# EAGLE design Board Design (EAGLE 9.6.0)
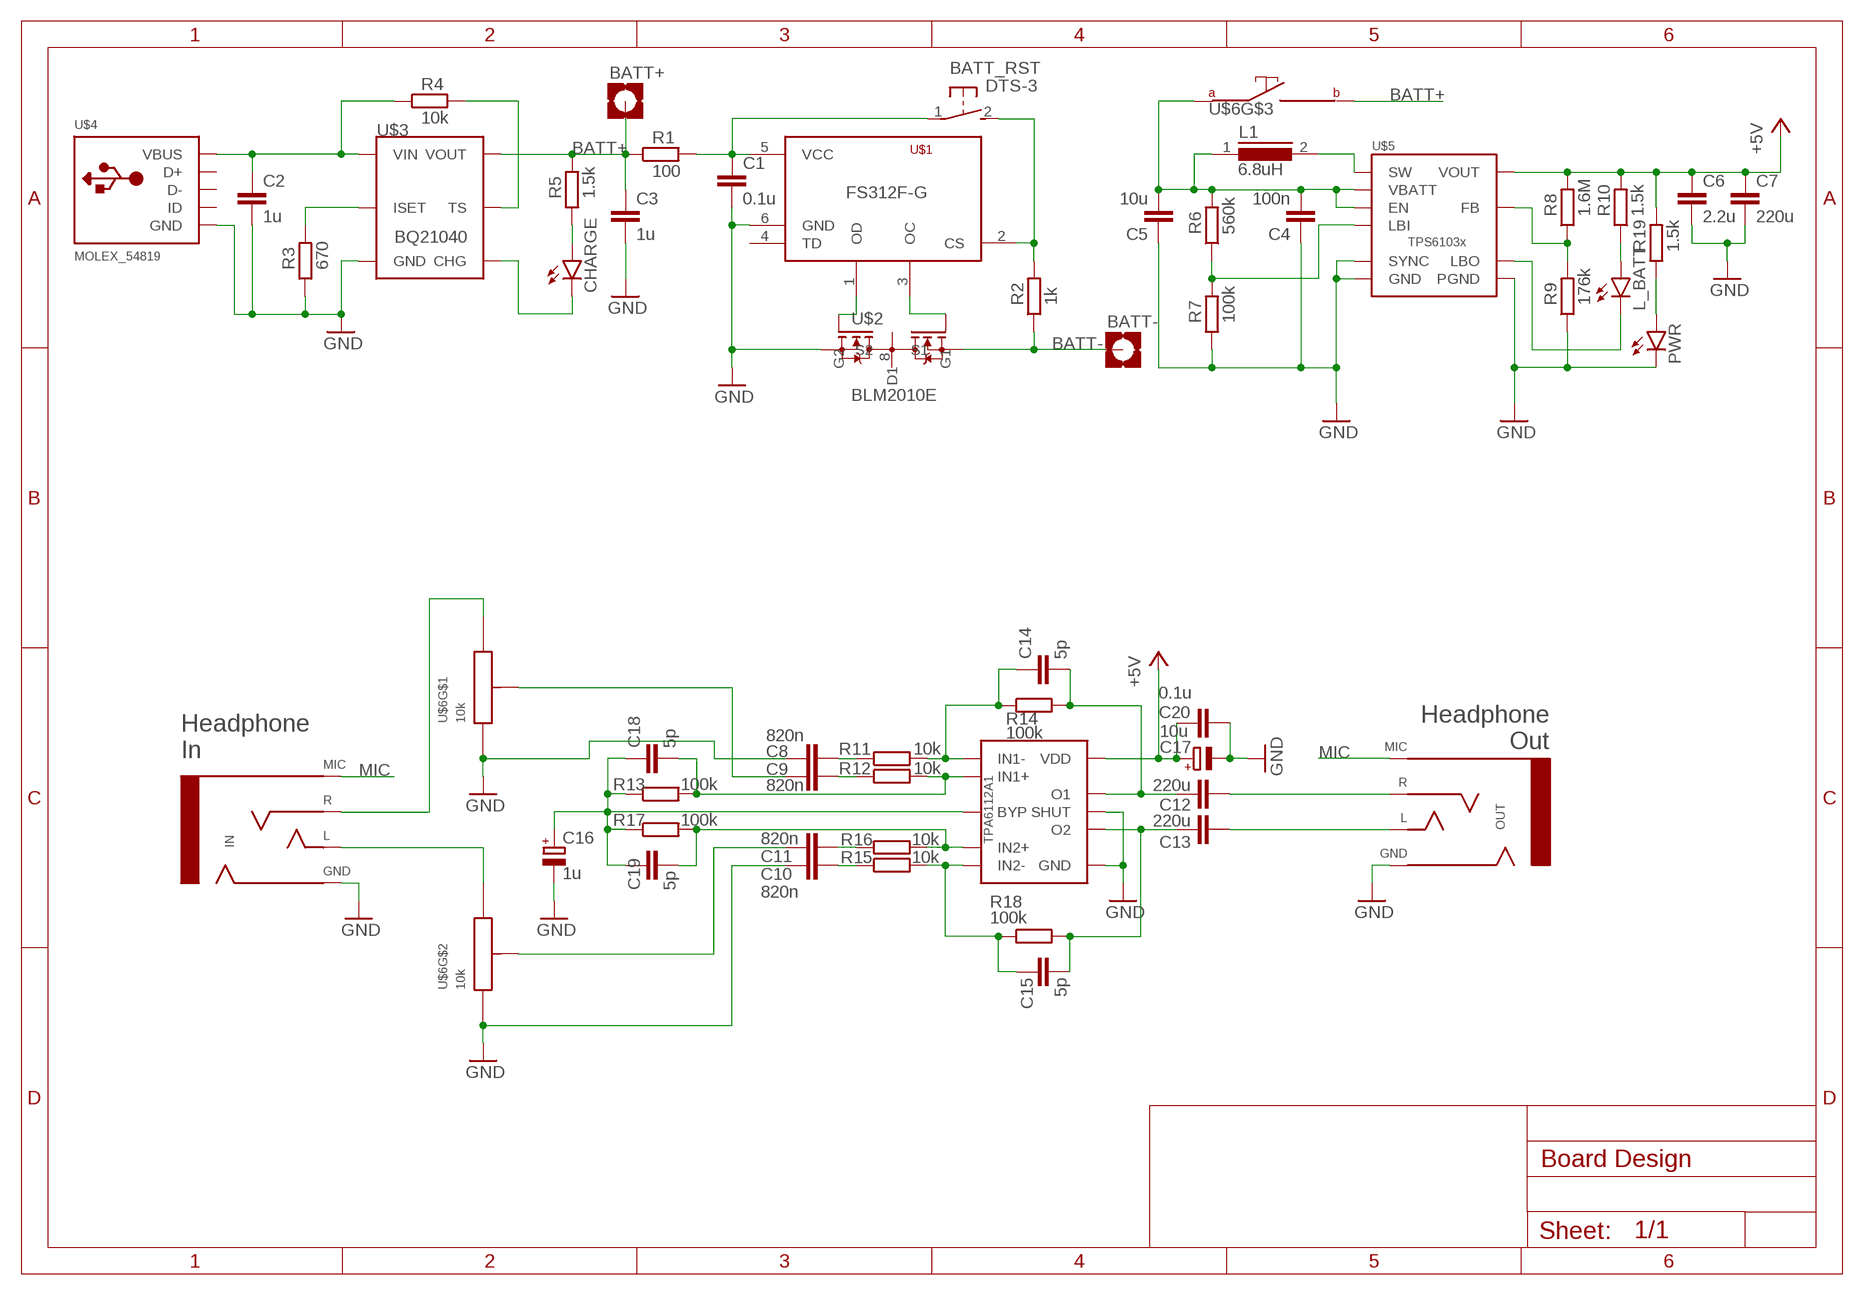
[diagram p0: schematic, sheet 1]

## Parts
BATT+  MOUNT-PAD-SQUARE2.8  [2,8-PAD-SQUARE]
BATT-  MOUNT-PAD-SQUARE2.8  [2,8-PAD-SQUARE]
BATT_RST  DTS-3  [DTS-3]
C1  0.1u  C-EUC1206  [C1206]
C2  1u  C-EUC1206  [C1206]
C3  1u  C-EUC1206  [C1206]
C4  100n  C-EUC1206  [C1206]
C5  10u  C-EUC1206  [C1206]
C6  2.2u  C-EUC1206  [C1206]
C7  220u  C-EUC1206  [C1206]
C8  820n  C-EUC1812  [C1812]
C9  820n  C-EUC1812  [C1812]
C10  820n  C-EUC1812  [C1812]
C11  820n  C-EUC1812  [C1812]
C12  220u  C-EUC1210  [C1210]
C13  220u  C-EUC1210  [C1210]
C14  5p  C-EUC1206  [C1206]
C15  5p  C-EUC1206  [C1206]
C16  1u  CPOL-EUB  [PANASONIC_B]
C17  10u  CPOL-EUB  [PANASONIC_B]
C18  5p  C-EUC1206  [C1206]
C19  5p  C-EUC1206  [C1206]
C20  0.1u  C-EUC1206  [C1206]
CHARGE  LEDSMT1206  [1206]
IN  PJ-35372  [PJ-35372]
L1  6.8uH  DR127  [DR127]
L_BATT  LEDSMT1206  [1206]
OUT  PJ-35372  [PJ-35372]
PWR  LEDSMT1206  [1206]
R1  100  R-EU_M1206  [M1206]
R2  1k  R-EU_M1206  [M1206]
R3  670  R-EU_M1206  [M1206]
R4  10k  R-EU_M1206  [M1206]
R5  1.5k  R-EU_M1206  [M1206]
R6  560k  R-EU_M1206  [M1206]
R7  100k  R-EU_M1206  [M1206]
R8  1.6M  R-EU_M1206  [M1206]
R9  176k  R-EU_M1206  [M1206]
R10  1.5k  R-EU_M1206  [M1206]
R11  10k  R-EU_0204/2V  [0204V]
R12  10k  R-EU_0204/2V  [0204V]
R13  100k  R-EU_0204/2V  [0204V]
R14  100k  R-EU_0204/2V  [0204V]
R15  10k  R-EU_0204/2V  [0204V]
R16  10k  R-EU_0204/2V  [0204V]
R17  100k  R-EU_0204/2V  [0204V]
R18  100k  R-EU_0204/2V  [0204V]
R19  1.5k  R-EU_M1206  [M1206]
TPA6112A1  TPA6112A2  [MSOP-10]
U$1  FS312F-G  [SOT23-6]
U$2  BLM2010E  [TSSOP8]
U$3  BQ21040M  [SOT23-6]
U$4  MOLEX_54819  [MOLEX_54819]
U$5  TPS61032  [TSSOP16L]
U$6  10k  RK097-DUAL-W/SWITCH  [RK097-DUAL-ELEMENT-W/SWITCH]

## Nets
+5V [Power]: C6.1 C7.1 C17.+ C20.1 R8.2 R10.2 R19.2 TPA6112A1.10(VDD) U$5.13(VOUT) U$5.14(VOUT) U$5.15(VOUT)
BATT+ [Power]: BATT+.B2,8(MOUNT) C3.1 R1.1 R5.2 U$3.2(VOUT) U$6.S2
BATT- [Power]: BATT-.B2,8(MOUNT) R2.1 U$2.2(S1) U$2.3(S1)
GND: C1.2 C2.2 C3.2 C4.1 C5.1 C6.2 C7.2 C8.1 C10.1 C16.- C17.- C20.2 IN.2(R2) IN.6(R2) OUT.2(R2) OUT.6(R2) PWR.C R3.1 R7.1 R9.1 TPA6112A1.5(GND) TPA6112A1.6(SHUT) U$1.6(GND) U$2.6(S2) U$2.7(S2) U$3.5(GND) U$4.GND U$5.3(PGND) U$5.4(PGND) U$5.5(PGND) U$5.8(SYNC) U$5.11(GND) U$6.1-1 U$6.2-1
MIC: IN.1(S) IN.5(S) OUT.1(S) OUT.5(S)
MNVMNV [Power]: C4.2 C5.2 L1.1 R6.2 U$5.6(VBATT) U$5.9(EN) U$6.S1
N$1 [Power]: C2.1 R4.1 U$3.4(VIN) U$4.VBUS
N$2: BATT_RST.1 C1.1 R1.2 U$1.5(VCC)
N$3: U$1.3(OC) U$2.4(G1)
N$4: U$1.1(OD) U$2.5(G2)
N$5: R3.2 U$3.6(ISET)
N$6: BATT_RST.2 R2.2 U$1.2(CS)
N$7: R4.2 U$3.1(TS)
N$8: CHARGE.A R5.1
N$9: CHARGE.C U$3.3(CHG)
N$10 [Power]: L1.2 U$5.1(SW) U$5.2(SW)
N$11: L_BATT.C U$5.10(LBO)
N$12: L_BATT.A R10.1
N$13: C16.+ C18.1 C19.1 R13.1 R17.1 TPA6112A1.4(BYP)
N$14: R8.1 R9.2 U$5.12(FB)
N$15: PWR.A R19.1
N$16: C12.1 C14.2 R14.2 TPA6112A1.1(O1)
N$17: R6.1 R7.2 U$5.7(LBI)
N$18: C13.1 C15.2 R18.2 TPA6112A1.9(O2)
N$19: C8.2 R11.1
N$20: C9.2 R12.1
N$21: C18.2 R12.2 R13.2 TPA6112A1.3(IN1+)
N$22: C14.1 R11.2 R14.1 TPA6112A1.2(IN1-)
N$23: C11.1 U$6.2-3
N$24: C19.2 R16.2 R17.2 TPA6112A1.7(IN2+)
N$25: C11.2 R16.1
N$26: C10.2 R15.1
N$27: C15.1 R15.2 R18.1 TPA6112A1.8(IN2-)
N$28: C9.1 U$6.1-3
N$30: IN.4(T) IN.8(T) U$6.2-2
N$31: IN.3(R1) IN.7(R1) U$6.1-2
N$32 [Power]: C13.2 OUT.4(T) OUT.8(T)
N$33 [Power]: C12.2 OUT.3(R1) OUT.7(R1)
Unconnected: U$1.4(TD) U$2.1(D1) U$2.8(D2) U$4.D+ U$4.D- U$4.ID

## Notes on the sheet
- Headphone
  Out
- Headphone
  In

## Library data of the parts
BATT+ BATT- = holes:MOUNT-PAD-SQUARE: MOUNTING PAD, square
BATT_RST = switch-tact:DTS-3
C1-C15 C18-C20 = rcl:C-EU: CAPACITOR, European symbol; SPICEPREFIX: C
C16 C17 = rcl:CPOL-EU: POLARIZED CAPACITOR, European symbol; SPICEPREFIX: C
CHARGE L_BATT PWR = led:LED: LED OSRAM: - CHIPLED LG R971, LG N971, LY N971, LG Q971, LY Q971, LO R971, LY R971 LH N974, LH R974 LS Q976, LO Q976, LY Q976 LO Q996 - Hyper CHIPLED LW Q18S LB Q993, LB Q99A, LB R99A - SideLED LS A670, LO A670, LY A670, LG A670, LP A670 LB A673, LV A673, LT A673, LW A673 LH A674 LY A675 LS A676, LA A676, LO A676, LY A676, LW A676 LS A679, LY A679, LG A679 - Hyper Micro SIDELED® LS Y876, LA Y876, LO Y876, LY Y876 LT Y87S - SmartLED LW L88C, LW L88S LB L89C, LB L89S, LG L890 LS L89K, LO L89K, LY L89K LS L896, LA L896, LO L896, LY L896 - TOPLED LS T670, LO T670, LY T670, LG T670, LP T670 LSG T670, LSP T670, LSY T670, LOP T670, LYG T670 LG T671, LOG T671, LSG T671 LB T673, LV T673, LT T673, LW T673 LH T674 LS T676, LA T676, LO T676, LY T676, LB T676, LH T676, LSB T676, LW T676 LB T67C, LV T67C, LT T67C, LS T67K, LO T67K, LY T67K, LW E67C LS E67B, LA E67B, LO E67B, LY E67B, LB E67C, LV E67C, LT E67C LW T67C LS T679, LY T679, LG T679 LS T770, LO T770, LY T770, LG T770, LP T770 LB T773, LV T773, LT T773, LW T773 LH T774 LS E675, LA E675, LY E675, LS T675 LS T776, LA T776, LO T776, LY T776, LB T776 LHGB T686 LT T68C, LB T68C - Hyper Mini TOPLED® LB M676 - Mini TOPLED Santana® LG M470 LS M47K, LO M47K, LY M47K Source: http://www.osram.convergy.de LUXEON: - LUMILED® LXK2-PW12-R00, LXK2-PW12-S00, LXK2-PW14-U00, LXK2-PW14-V00 LXK2-PM12-R00, LXK2-PM12-S00, LXK2-PM14-U00 LXK2-PE12-Q00, LXK2-PE12-R00, LXK2-PE12-S00, LXK2-PE14-T00, LXK2-PE14-U00 LXK2-PB12-K00, LXK2-PB12-L00, LXK2-PB12-M00, LXK2-PB14-N00, LXK2-PB14-P00, LXK2-PB14-Q00 LXK2-PR12-L00, LXK2-PR12-M00, LXK2-PR14-Q00, LXK2-PR14-R00 LXK2-PD12-Q00, LXK2-PD12-R00, LXK2-PD12-S00 LXK2-PH12-R00, LXK2-PH12-S00 LXK2-PL12-P00, LXK2-PL12-Q00, LXK2-PL12-R00 Source: www.luxeon.com KINGBRIGHT: KA-3528ASYC Source: www.kingbright.com
IN OUT = Connectors_Custom:PJ-35372
L1 = inductors:DR127: High Power Density, High Efficiency, Shielded Inductors Source: coiltronics_dr_series.pdf; SPICEPREFIX: L
R1-R19 = rcl:R-EU_: RESISTOR, European symbol; SPICEPREFIX: R
TPA6112A1 = Misc ICs:TPA6112A2
U$1 = Misc ICs:FS312F-G
U$2 = Misc ICs:BLM2010E
U$3 = Misc ICs:BQ21040M; SPICEPREFIX: X
U$4 = Connectors_Custom:MOLEX_54819
U$5 = Misc ICs:TPS61032; SPICEPREFIX: X
U$6 = alps_japan_potentiometers:RK097-DUAL-W/SWITCH: My symbol for Apls RK097 Dual Pot with Switch Part.

## Net classes
1 Power: width 0.15 mm, clearance 0.15 mm

## Board
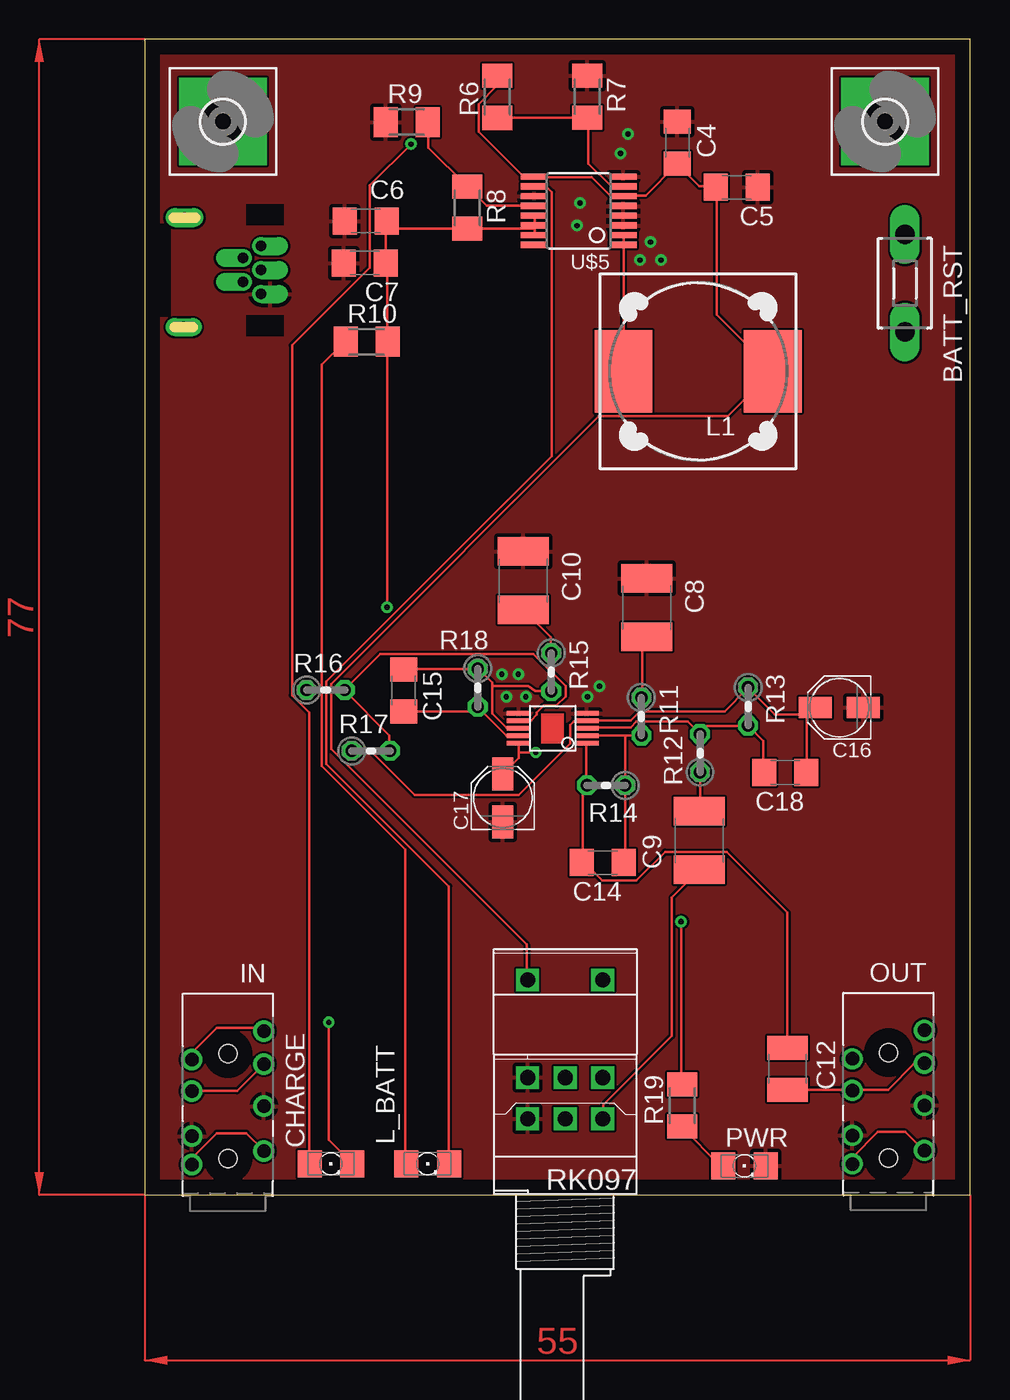
[diagram p1: board, top side]
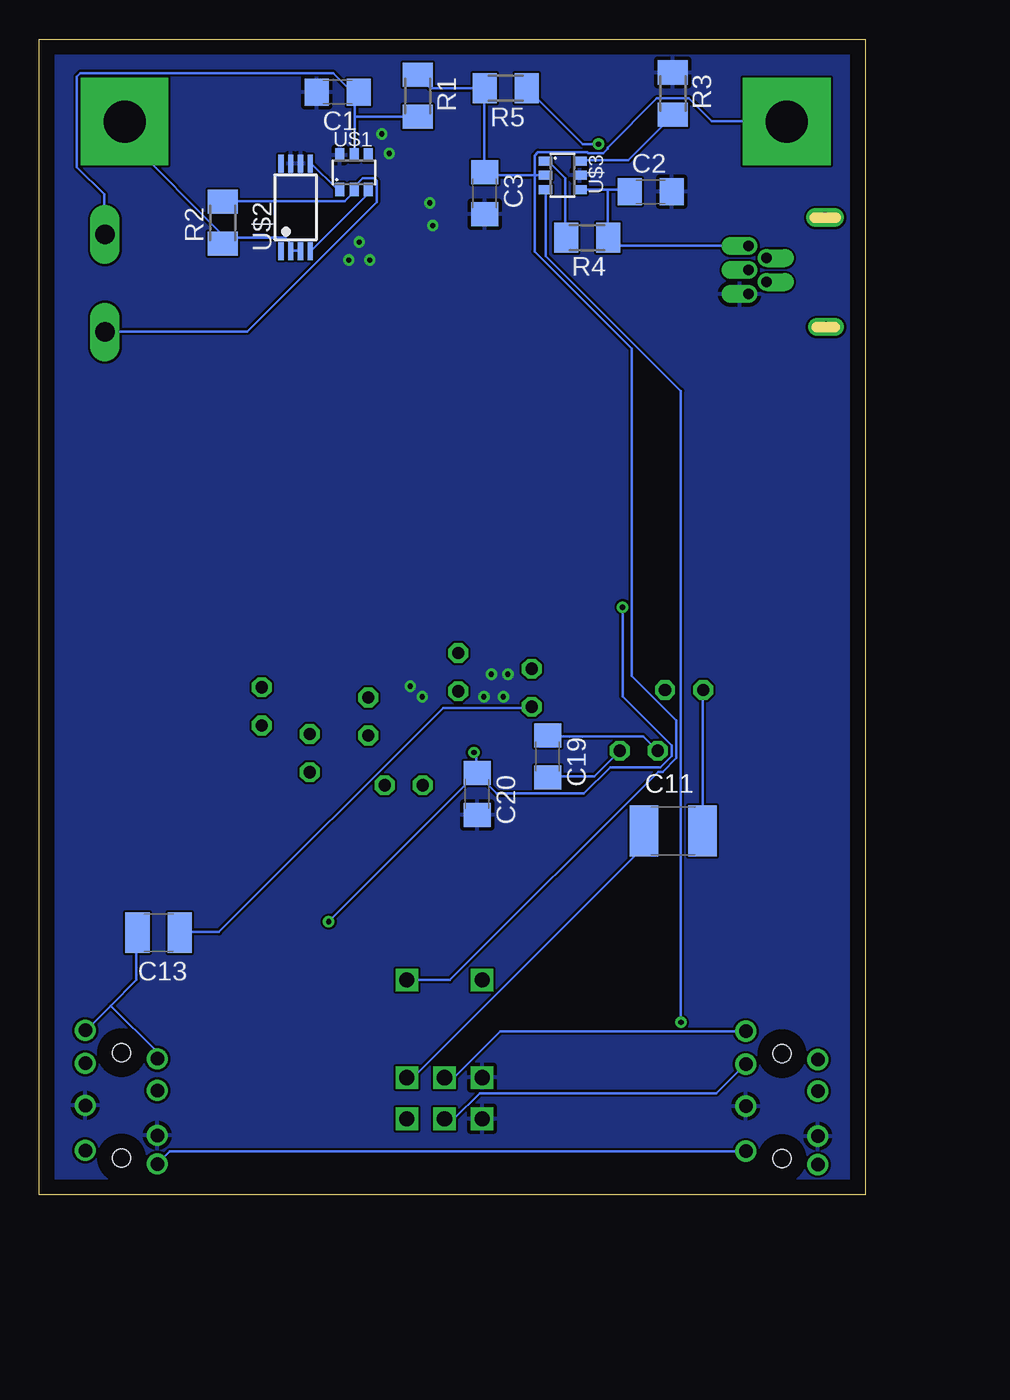
[diagram p2: board, bottom side, seen from below]

Size 55 x 77 mm. Coordinates in mm from the lower left corner, seen from the top.
Outline: 0,0 55,0 55,77 0,77 0,0
Copper layers (1*16): Top 0.035mm / dielectric 1.5mm / Bottom 0.035mm
Design rules "default": minimum track width 6mil, minimum drill 0.35mm, track to track 6mil, track to pad 6mil, pad to pad 6mil, via to via 6mil, smd to smd 6mil, copper to edge 40mil, drill to drill 6mil, minimum pad ring 10mil, minimum via ring 8mil, stop-mask expansion 4mil, vias tented up to drill 0mil, thermal gap 10mil

### Footprints (pad centres in the part's own frame; a part is rotated, then mirrored left to right if it is on the bottom)
2,8-PAD-SQUARE = drill 2.8 pad 5.842 square: B2,8 0,0
DTS-3 = drill 1.3 long: 1 -3.25,0; 2 3.25,0
C1206 = smd 1.6 x 1.8: 1 -1.4,0; 2 1.4,0
C1812 = smd 1.9 x 3.4: 1 -1.95,0; 2 1.95,0
C1210 = smd 1.6 x 2.7: 1 -1.4,0; 2 1.4,0
PANASONIC_B = smd 2.2 x 1.4: + 1.6,0; - -1.6,0
1206 = smd 1.6 x 1.803: A -1.422,0; C 1.422,0
PJ-35372 = drill 0.9: 1 4,-2.4; 2 7,-2.4; 3 9.8,-2.4; 4 12,-2.4; 5 3.1,2.4; 6 5,2.4; 7 8,2.4; 8 10.1,2.4 | hole 1.2: 3.5,0; 10.5,0
DR127 = smd 3.85 x 5.5: 1 -4.975,0; 2 4.975,0
M1206 = smd 1.6 x 2: 1 -1.4,0; 2 1.4,0
0204V = drill 0.813 octagon: 1 -1.27,0; 2 1.27,0
MSOP-10 = smd 0.3 x 1.6: 1 -1,-2.25; 2 -0.5,-2.25; 3 0,-2.25; 4 0.5,-2.25; 5 1,-2.25; 6 1,2.25; 7 0.5,2.25; 8 0,2.25; 9 -0.5,2.25; 10 -1,2.25
SOT23-6 = smd 0.6 x 0.9: 1 -0.95,-1.15; 2 0,-1.15; 3 0.95,-1.15; 4 0.95,1.15; 5 0,1.15; 6 -0.95,1.15
TSSOP8 = smd 0.35 x 1.2: 1 -0.975,-2.925; 2 -0.325,-2.925; 3 0.325,-2.925; 4 0.975,-2.925; 5 0.975,2.925; 6 0.325,2.925; 7 -0.325,2.925; 8 -0.975,2.925
MOLEX_54819 = drill 0.7 offset: D+ 0,0; D- -1.2,0.8; GND 0,-1.6; ID -1.2,-0.8; VBUS 0,1.6 | drill 0.7 long: P$1 -5.15,-3.8 | drill 0.7 pad 1.27 long: P$2 -5.1,3.5
TSSOP16L = smd 0.42 x 1.78: 1 -2.275,-2.97; 2 -1.625,-2.97; 3 -0.975,-2.97; 4 -0.325,-2.97; 5 0.325,-2.97; 6 0.975,-2.97; 7 1.625,-2.97; 8 2.275,-2.97; 9 2.275,2.97; 10 1.625,2.97; 11 0.975,2.97; 12 0.325,2.97; 13 -0.325,2.97; 14 -0.975,2.97; 15 -1.625,2.97; 16 -2.275,2.97
RK097-DUAL-ELEMENT-W/SWITCH = drill 1 pad 1.422 square: 1-1 -2.5,-0.06; 1-2 0,-0.06; 1-3 2.5,-0.06; 2-1 -2.5,2.69; 2-2 0,2.69; 2-3 2.5,2.69; S1 -2.5,9.19; S2 2.5,9.19

### Placement (x,y rotation side)
BATT+  5.22,71.53 0 top
BATT-  49.33,71.53 0 top
BATT_RST  50.64,60.75 270 top
C1  35.12,73.5 180 bottom
C2  14.29,66.85 0 bottom
C3  25.35,66.77 270 bottom
C4  35.5,70.13 270 top
C5  39.45,67.15 180 top
C6  14.73,64.9 180 top
C7  14.68,62.1 180 top
C8  33.44,39.14 270 top
C9  36.96,23.61 90 top
C10  25.24,40.94 270 top
C11  12.79,24.26 0 bottom
C12  42.83,8.39 270 top
C13  47.07,17.47 180 bottom
C14  30.53,22.15 180 top
C15  17.25,33.61 270 top
C16  46.29,32.47 180 top
C17  23.87,26.46 90 top
C18  42.69,28.15 180 top
C19  21.15,29.23 270 bottom
C20  25.85,26.71 270 bottom
CHARGE  12.41,2.08 0 top
IN  5.55,-1.08 90 top
L1  36.88,54.88 180 top
L_BATT  18.86,2.08 0 top
OUT  49.55,-1.03 90 top
PWR  39.96,1.94 0 top
R1  29.8,73.24 270 bottom
R2  42.8,64.78 90 bottom
R3  12.8,73.4 270 bottom
R4  18.52,63.8 180 bottom
R5  23.94,73.75 180 bottom
R6  23.5,73.17 90 top
R7  29.5,73.18 270 top
R8  21.5,65.78 270 top
R9  17.47,71.5 0 top
R10  14.79,56.85 0 top
R11  33.1,31.88 270 top
R12  37,29.44 90 top
R13  40.2,32.56 270 top
R14  30.74,27.3 180 top
R15  27.1,34.84 270 top
R16  12.06,33.65 0 top
R17  15.08,29.6 0 top
R18  22.2,33.8 270 top
R19  35.81,5.96 90 top
TPA6112A1  27.19,31.09 90 top
U$1  34.04,68.15 0 bottom
U$2  37.93,65.81 0 bottom
U$3  20.15,67.95 270 bottom
U$4  7.76,61.64 0 top
U$5  28.92,65.58 90 top
U$6  28.02,5.13 0 top

### Tracks (layer width: path | path; a pad name or v marks a point on that pad's centre or on a via)
+5V  (via drill 0.35)
  Top 0.152: 25.98,64.39 25.98,64.54 U$5.14 25.98,64.62 25.98,65.23 U$5.13 | 25.98,64.39 25.98,64.01 U$5.15 | 25.98,64.39 21.57,64.39 R8.2 21.49,64.39 16.08,64.39 | 16.08,64.39 16.08,64.85 C6.1 16.08,64.39 | 16.08,64.39 C7.1 16.15,62.03 16.15,56.92 R10.2 16.15,56.84 v16.15,39.17 | 24.92,29.49 24.92,29.11 23.93,28.12 C17.+ | 24.92,29.49 24.92,30.02 TPA6112A1.10 | 24.92,29.49 v26.06,29.49 | v35.74,18.21 35.74,7.39 R19.2
  Bottom 0.152: v26.06,29.49 25.91,29.34 25.91,28.12 C20.1 | v35.74,18.21 25.91,28.04 C20.1 | v16.15,39.17 16.15,33.22 12.88,29.95 12.88,29.26 13.64,28.5 16.99,28.5 18.75,26.75 24.54,26.75 25.83,28.04 C20.1
BATT+
  Bottom 0.152: 22.02,67.97 25.15,67.97 25.3,68.12 C3.1 25.38,68.2 25.38,73.69 R5.2 25.38,73.76 28.96,73.76 29.79,74.6 R1.1 | 22.02,67.97 21.34,67.97 U$3.2 | 22.02,67.97 22.02,62.87 15.54,56.39 15.54,34.59 12.57,31.62 12.57,29.11 13.49,28.19 13.79,28.19 27.66,14.33 30.48,14.33 U$6.S2 | 22.02,67.97 22.02,69.27 21.79,69.49 18.52,69.49 18.44,69.42 17.45,69.42 17.14,69.72 17.14,69.8 13.87,73.08 11.73,73.08 10.21,71.55 5.26,71.55 BATT+.B2,8
BATT-
  Bottom 0.152: U$2.3 37.64,62.94 38.25,62.94 U$2.2 38.25,63.02 38.25,63.4 38.63,63.78 42.37,63.78 42.75,63.4 R2.1 42.52,63.7 49.3,70.48 49.3,71.48 BATT-.B2,8
GND  (via drill 0.35)
  other vias: 32.2,70.7 31.7,69.4 29,66.1 28.8,64.6 33,62.3 34.4,62.3 33.7,63.5 23.8,34.7 24.9,34.7 24.1,33.2 25.4,33.2 29.5,33.2 30.3,33.9
  pour Top: -1,79 57,79 57,-3 -1,-3
  pour Bottom: -2,80 59,80 59,-5 -2,-5
MIC
  Top 0.152: IN.5 3.2,2.06 3.2,2.52 4.8,4.12 6.78,4.12 7.92,2.97 IN.1 | OUT.5 47.17,2.13 47.17,2.52 48.84,4.19 50.67,4.19 51.89,2.97 OUT.1
  Bottom 0.152: IN.1 8,2.9 46.33,2.9 47.09,2.13 OUT.5
MNVMNV
  Top 0.152: R6.2 23.47,74.52 23.47,73.91 22.25,72.69 22.25,70.87 25.22,67.89 25.91,67.89 U$5.9 25.98,67.82 29.79,67.82 31.01,66.6 31.85,66.6 U$5.6 31.93,66.6 33.38,66.6 35.43,68.66 C4.2 35.51,68.66 36.96,67.21 38.02,67.21 C5.2 38.1,67.13 38.1,58.67 41.83,54.94 L1.1 41.83,54.86 38.86,51.89 30.25,51.89 12.42,34.06 12.42,29.72 25.45,16.69 25.45,14.33 U$6.S1
N$1
  Bottom 0.152: 17.14,66.98 15.77,66.98 15.7,66.9 C2.1 | 17.14,66.98 18.97,66.98 U$3.4 | 17.14,66.98 17.14,63.86 R4.1 17.07,63.78 16.54,63.25 7.77,63.25 U$4.VBUS
N$2
  Bottom 0.152: 33.98,71.86 33.98,73.23 33.76,73.46 C1.1 33.98,73.3 35.43,74.75 52.27,74.75 52.5,74.52 52.5,68.5 50.67,66.67 50.67,64.01 BATT_RST.1 | 33.98,71.86 33.98,69.34 U$1.5 | 33.98,71.86 29.87,71.86 R1.2
N$3
  Bottom 0.152: U$1.3 33.15,66.98 33.15,66.67 36.88,62.94 U$2.4
N$4
  Bottom 0.152: U$1.1 35.05,67.06 35.2,67.06 36.88,68.73 U$2.5
N$5
  Bottom 0.152: U$3.6 18.97,68.96 15.77,68.96 12.8,71.93 R3.2
N$6
  Bottom 0.152: R2.2 42.75,66.22 34.67,66.22 34.06,66.83 34.06,66.98 U$1.2 33.98,67.06 33.98,67.21 33.45,67.74 32.69,67.74 32.54,67.59 32.54,66.14 41.15,57.53 50.6,57.53 BATT_RST.2
N$7
  Bottom 0.152: U$3.1 21.26,68.89 21.11,68.89 19.96,67.74 19.96,63.86 R4.2
N$8  (via drill 0.35)
  Top 0.152: v17.75,70.03 15.01,67.28 15.01,61.8 9.83,56.62 9.83,33.3 10.97,32.16 10.97,2.13 CHARGE.A
  Bottom 0.152: v17.75,70.03 18.82,70.03 22.48,73.69 R5.1
N$9  (via drill 0.35)
  Top 0.152: v12.27,11.51 12.27,3.66 13.79,2.13 CHARGE.C
  Bottom 0.152: v12.27,11.51 12.27,53.57 21.26,62.56 21.26,66.98 U$3.3
N$10
  Top 0.152: U$5.2 31.93,63.93 31.93,63.32 U$5.1 31.93,63.25 31.93,54.94 L1.2
N$11
  Top 0.152: U$5.10 25.98,67.13 26.82,67.13 27.13,66.83 27.13,49.23 12.12,34.21 12.12,28.73 20.27,20.57 20.27,2.13 L_BATT.C
N$12
  Top 0.152: L_BATT.A 17.37,2.13 17.37,23.01 11.81,28.57 11.81,55.32 13.34,56.84 R10.1
N$13
  Top 0.152: C18.1 44.12,28.19 44.12,31.93 44.65,32.46 C16.+ 44.12,32 41.99,32 40.23,33.76 R13.1 40.16,33.76 38.63,32.23 32.99,32.23 32.38,31.62 29.49,31.62 TPA6112A1.4 29.41,31.55 28.57,31.55 28.35,31.32 28.35,30.1 24.92,26.67 17.98,26.67 15.09,29.57 13.87,29.57 R17.1
  Bottom 0.152: C19.1 21.11,30.56 14.78,30.56 13.87,29.64 R17.1
N$14
  Top 0.152: U$5.12 25.91,65.91 22.78,65.91 21.57,67.13 R8.1 21.49,67.21 18.9,69.8 18.9,71.48 R9.2
N$15
  Top 0.152: PWR.A 38.48,1.98 38.33,1.98 35.81,4.5 R19.1
N$16
  Top 0.152: TPA6112A1.1 29.41,30.02 29.41,27.36 R14.2 29.41,27.28 29.18,27.05 29.18,22.17 C14.2 29.26,22.17 30.48,20.95 32.77,20.95 34.67,22.86 38.79,22.86 42.82,18.82 42.82,9.83 C12.1
N$17
  Top 0.152: U$5.7 31.85,67.21 31.09,67.21 29.57,68.73 29.57,71.7 R7.2 23.55,71.78 R6.1
N$18
  Top 0.152: TPA6112A1.9 24.92,30.63 24.08,30.63 22.25,32.46 R18.2 22.17,32.46 21.95,32.23 17.3,32.23 C15.2
  Bottom 0.152: C13.1 45.64,17.53 43.05,17.53 28.12,32.46 22.25,32.46 R18.2
N$19
  Top 0.152: R11.1 33.15,33.22 33.15,36.96 33.38,37.19 C8.2
N$20
  Top 0.152: R12.1 37.03,28.12 37.03,25.6 C9.2
N$21
  Top 0.152: C18.2 41.22,28.19 41.22,30.25 40.23,31.24 R13.2 40.16,31.24 37.49,31.24 37.03,30.79 R12.2 36.96,30.79 36.2,31.55 32.77,31.55 32.38,31.17 29.49,31.17 TPA6112A1.3
N$22
  Top 0.152: 32,30.63 33.07,30.63 R11.2 | 32,30.63 29.49,30.63 TPA6112A1.2 | C14.1 32,22.17 32,27.28 R14.1 32,27.36 32,30.63
N$23
  Bottom 0.152: U$6.2-3 30.48,7.85 30.1,7.85 14.78,23.16 14.78,24.23 C11.1
N$24
  Top 0.152: TPA6112A1.7 24.99,31.62 25.76,31.62 26.14,32 26.14,32.16 26.59,32.61 27.43,32.61 28.04,33.22 28.04,33.91 25.91,36.04 15.7,36.04 13.34,33.68 R16.2 13.34,33.6 16.31,30.63 16.31,29.64 R17.2
  Bottom 0.152: C19.2 21.11,27.89 18.06,27.89 16.38,29.57 R17.2
N$25
  Bottom 0.152: R16.1 10.82,33.6 10.82,24.31 C11.2
N$26
  Top 0.152: R15.1 27.05,36.12 27.05,37.19 25.3,38.94 C10.2
N$27
  Top 0.152: 23.16,33.9 23.16,34.14 22.25,35.05 R18.1 22.17,35.05 17.3,35.05 C15.1 | TPA6112A1.8 24.92,31.17 24.08,31.17 23.16,32.08 23.16,33.9 | 23.16,33.9 25.55,33.9 26.03,33.57 R15.2
N$28
  Top 0.152: U$6.1-3 30.56,5.11 30.56,6.02 35.13,10.59 35.13,19.81 36.96,21.64 C9.1
N$30
  Top 0.152: IN.8 3.2,9.07 3.2,9.53 4.8,11.12 7.77,11.12 7.92,10.97 IN.4
  Bottom 0.152: U$6.2-2 27.96,7.85 27.36,7.85 24.31,10.9 8,10.9 IN.4
N$31
  Top 0.152: IN.7 3.2,6.93 6.17,6.93 7.92,8.69 IN.3
  Bottom 0.152: U$6.1-2 27.96,5.11 27.36,5.11 25.68,6.78 9.91,6.78 8,8.69 IN.3
N$32
  Bottom 0.152: 50.25,12.61 51.89,10.97 OUT.4 | 50.25,12.61 48.54,14.33 48.54,17.45 C13.2 | 50.25,12.61 47.17,9.53 47.17,9.14 OUT.8
N$33
  Top 0.152: C12.2 42.9,7.01 47.09,7.01 OUT.7 47.17,7.01 49.53,7.01 51.28,8.76 51.89,8.76 OUT.3
(copper drawn outside any net)
  shapes: Top area x2